# Altium project WCTopping.PrjPcb
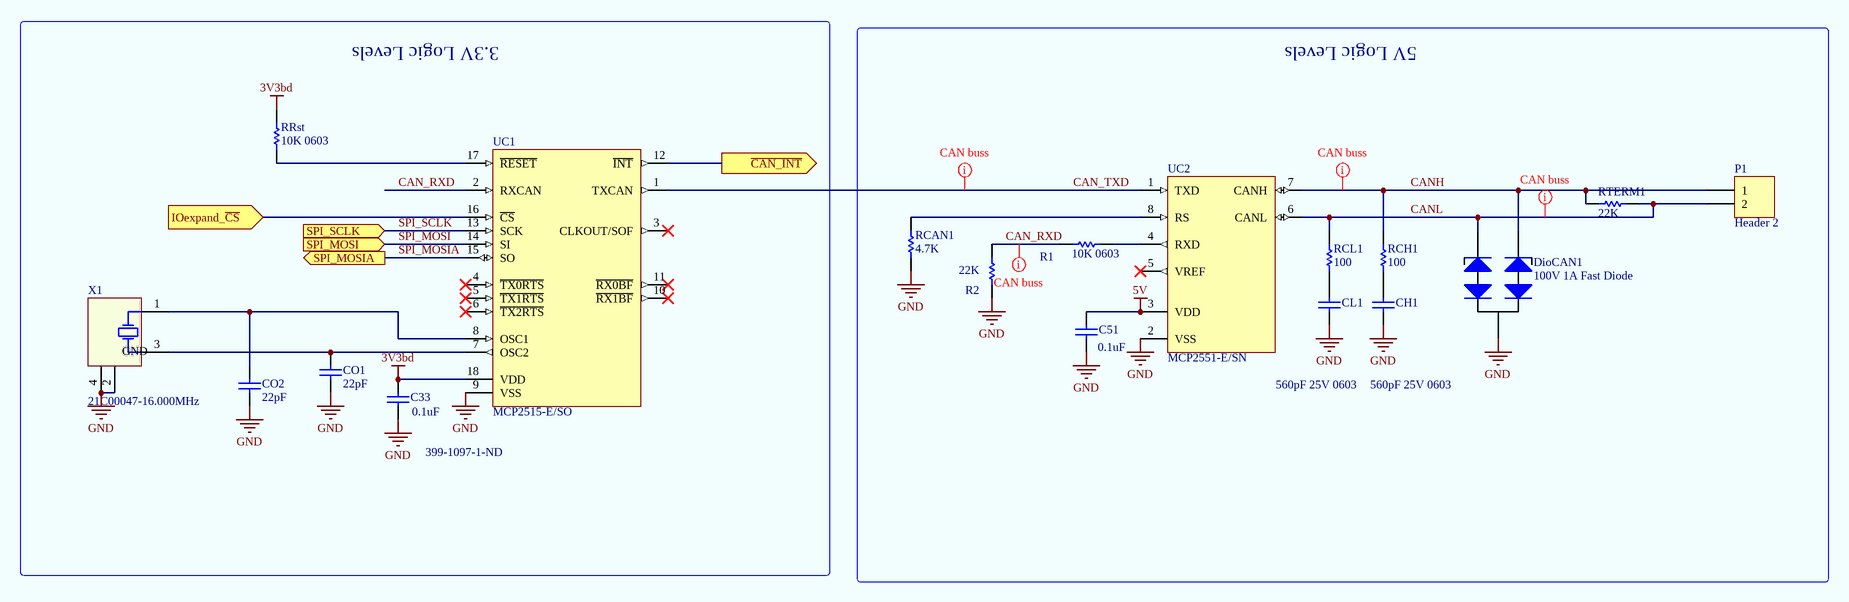
[diagram p0: CAN_Interface.SchDoc]
DrawnBy: TrainingTeam; Project_Name: WC Topping; Revision: 1.2; Title: Altium - Essential Training Example
3 sheets, 35 parts. Net scope: flat (ports and power ports of the same name join across sheets).
Board file: WCTopping.PcbDoc
Sheets:
  CAN_Interface.SchDoc
  Processor_Interface.SchDoc
  Digital_IO.SchDoc

## Sheet CAN_Interface.SchDoc: CAN Bus Interface Logic
size B; Engineer: Daisy Chain; DocumentNumber: 3; Revision: 2.3; SheetNumber: 3; SheetTotal: 5

### Parts
C33  0.1uF  Supplier Part Number 1: 399-1097-1-ND  [0603C_L]
C51  0.1uF  [0603C_L]
CH1  560pF 25V 0603  [0603C_L]
CL1  560pF 25V 0603  [0603C_L]
CO1  22pF  [0603C_L]
CO2  22pF  [0603C_L]
DioCAN1  100V 1A Fast Diode  [SOT23]
P1  Header 2  [HDR1X2]
R1  10K 0603  [0603_L]
R2  22K  [0603_L]
RCAN1  4.7K  [0603_L]
RCH1  100  [0603_L]
RCL1  100  [0603_L]
RRst  10K 0603  [0603_L]
RTERM1  22K  [0603_L]
UC1  MCP2515-E/SO  [SOIC-SO18_M]
UC2  MCP2551-E/SN  [SOIC-SN8_N]
X1  21C00047-16.000MHz  [ITTI-21C00047-16.000MHz-4_V]

### Blocks framed on the sheet
3.3V Logic Levels: C33 CO1 CO2 RRst UC1 X1
5V Logic Levels: C51 CH1 CL1 DioCAN1 P1 R1 R2 RCAN1 RCH1 RCL1 RTERM1 UC2

### Ports
IOexpand_~{CS} (in), SPI_MOSI (in), SPI_MOSIA (out), SPI_SCLK (in), ~{CAN_INT} (out)

### Nets
3V3bd: C33.2 RRst.2 UC1.18(VDD)
5V: C51.2 UC2.3(VDD)
GND: C33.1 C51.1 CH1.2 CL1.1 CO1.1 CO2.2 DioCAN1.3 R2.1 RCAN1.1 UC1.9(VSS) UC2.2(VSS) X1.2(GND) X1.4(GND)
CAN_RXD: R1.2 R2.2 UC1.2(RXCAN)
CAN_TXD: UC1.1(TXCAN) UC2.1(TXD)
CANH: DioCAN1.1(A) P1.1 RCH1.2 RTERM1.2 UC2.7(CANH)
CANL: DioCAN1.2(K) P1.2 RCL1.2 RTERM1.1 UC2.6(CANL)
GPIO4: UC1.16(~{CS}) ; port IOexpand_~{CS}
GPIO20: UC1.12(~{INT}) ; port ~{CAN_INT}
SPI_MOSI: UC1.14(SI) ; port SPI_MOSI
SPI_MOSIA: UC1.15(SO) ; port SPI_MOSIA
SPI_SCLK: UC1.13(SCK) ; port SPI_SCLK
NetCH1_1: CH1.1 RCH1.1
NetCL1_2: CL1.2 RCL1.1
NetCO1_2: CO1.2 UC1.7(OSC2) X1.3(XTAL)
NetCO2_1: CO2.1 UC1.8(OSC1) X1.1(XTAL)
NetR1_1: R1.1 UC2.4(RXD)
NetRCAN1_2: RCAN1.2 UC2.8(RS)
NetRRst_1: RRst.1 UC1.17(~{RESET})

Not connected (* = marked no-connect by the designer): UC1 3(CLKOUT/SOF)* 4(~{TX0RTS})* 5(~{TX1RTS})* 6(~{TX2RTS})* 10(~{RX1BF})* 11(~{RX0BF})*; UC2 5(VREF)*

### Layout directives
net class CAN; rule Width Constraint [Pref Width = 20mil    Min Width = 10mil    Max Width = 30mil]; rule Clearance Constraint [Clearance = 20mil]: CAN_RXD, CAN_TXD, CANH, CANL

### Notes on the sheet
- Title
- Size:
- Date:
- B
- Project:
- Time:
- Revision:
- Sheet
- of
- Engineer:
- File:

### Library data of the parts
C33 = Cap10uF_25V_0603: Manufacturer: Kemet; Manufacturer Part Number: C0603C104J4RACTU; Capacitance: 100nF; Tolerance: 5%; Voltage Rating: 16V; Type (Capacitors): X7R; Supplier 1: Digikey; Stock 1: 1096346; Pricing 1: 1=0.11, 10=0.078, 25=0.0572, 50=0.0446, 100=0.0369, 250=0.0305, 500=0.0259, 1000=0.0214 (USD); Mount: Surface Mount; Case/Package: 0603; Pins: 2; Case Code (Metric): 1608; Case Code (Imperial): 0603; Min Operating Temperature: -55°C; Max Operating Temperature: 125°C; Package Quantity: 4000; Packaging: Tape and Reel; Voltage Rating (DC): 16V; Length: 1.6mm; Height: 0.8mm; Width: 0.8mm; Radiation Hardening: No; REACH SVHC: No SVHC; ComponentLink1URL: https://datasheet.ciiva.com/14589/70095383-14589531.pdf; ComponentLink1Description: https://datasheet.ciiva.com/14589/70095383-14589531.pdf; ComponentLink2URL: https://datasheet.ciiva.com/28645/1851736-28645613.pdf; ComponentLink2Description: https://datasheet.ciiva.com/28645/1851736-28645613.pdf; ComponentLink3URL: https://datasheet.ciiva.com/5999/1732731-5999390.pdf; ComponentLink3Description: https://datasheet.ciiva.com/5999/1732731-5999390.pdf; ComponentLink4URL: https://datasheet.ciiva.com/7823/kem-c1002-x7r-smd-7823982.pdf; ComponentLink4Description: https://datasheet.ciiva.com/7823/kem-c1002-x7r-smd-7823982.pdf
C51 = Cap10uF_25V_0603
CH1 CL1 = Cap560pF_25V_0603: Manufacturer: Taiyo Yuden; Manufacturer Part Number: TMK316F106ZL-T; Catalog Drawings: xMK Series_1206_1.6; Capacitance: 10µF; Tolerance: -20%, +80%; Temperature Coefficient: Y5V (F); Online Catalog: M Series; Other Names: 587-1353-6; Supplier 1: Ciiva; Stock 1: 330483; Pricing 1: 1=0.34, 10=0.255, 50=0.1488, 100=0.119, 250=0.085, 500=0.0578, 1000=0.0468 (USD); Standard Package: 1; Category: Capacitors; Family: Ceramic Capacitors; Series: M; Packaging: Digi-Reel®; Voltage - Rated: 25V; Mounting Type: Surface Mount, MLCC; Operating Temperature: -30°C ~ 85°C; Applications: General Purpose; Ratings: -; Package / Case: 1206 (3216 Metric); Size / Dimension: 0.126" L x 0.063" W (3.20mm x 1.60mm); Height - Seated (Max): -; Thickness (Max): 0.071" (1.80mm); Lead Spacing: -; Features: -; Lead Style: -; ComponentLink1URL: https://datasheet.ciiva.com/30217/73tmk316f106zl-t-30217817.pdf; ComponentLink1Description: https://datasheet.ciiva.com/30217/73tmk316f106zl-t-30217817.pdf; ComponentLink2URL: https://datasheet.ciiva.com/11596/tmk316f106zl-t-ss-11596490.pdf; ComponentLink2Description: https://datasheet.ciiva.com/11596/tmk316f106zl-t-ss-11596490.pdf; ComponentLink3URL: https://datasheet.ciiva.com/137/tmk316f106zl-t-ss-137061.pdf; ComponentLink3Description: https://datasheet.ciiva.com/137/tmk316f106zl-t-ss-137061.pdf; ComponentLink4URL: https://datasheet.ciiva.com/15922/1123tmk316f106zl-t-15922467.pdf; ComponentLink4Description: https://datasheet.ciiva.com/15922/1123tmk316f106zl-t-15922467.pdf; ComponentLink5URL: https://datasheet.ciiva.com/7975/746258-7975854.pdf; ComponentLink5Description: https://datasheet.ciiva.com/7975/746258-7975854.pdf; ComponentLink6URL: https://datasheet.ciiva.com/7975/1693457-7975853.pdf; ComponentLink6Description: https://datasheet.ciiva.com/7975/1693457-7975853.pdf; ComponentLink7URL: https://datasheet.ciiva.com/5744/1497285-5744889.pdf; ComponentLink7Description: https://datasheet.ciiva.com/5744/1497285-5744889.pdf; Supplier Part Number 1: 587-1353-1-ND
CO1 = Cap22pF_50V_0603: Manufacturer: Murata; Manufacturer Part Number: GRM1885C1H220JA01D; Capacitance: 22; Voltage Rating: 50; Tolerance: 5; Type (Capacitors): C0G; Supplier 1: Digikey; Supplier Part Number 1: 490-1411-1-ND; Stock 1: 517556; Pricing 1: 1=0.1, 10=0.061, 50=0.0332, 100=0.0281, 250=0.023, 500=0.0196, 1000=0.0153 (USD); Mount: Surface Mount; Case/Package: 0603; Pins: 2; Case Code (Metric): 1608; Case Code (Imperial): 0603; Min Operating Temperature: -55; Max Operating Temperature: 125; Package Quantity: 1; Packaging: Cut Tape; Voltage Rating (DC): 50; Lead Pitch: 4; Length: 1.6; Height: 0.8; Width: 0.8; Radiation Hardening: No; REACH SVHC: No SVHC; ComponentLink1URL: https://datasheet.ciiva.com/131/product-131760.pdf; ComponentLink1Description: https://datasheet.ciiva.com/131/product-131760.pdf; ComponentLink2URL: https://datasheet.ciiva.com/131/partnumbering-e-01-131761.pdf; ComponentLink2Description: https://datasheet.ciiva.com/131/partnumbering-e-01-131761.pdf; ComponentLink3URL: https://datasheet.ciiva.com/14116/grmseries-tc-hitype-eng-14116853.pdf; ComponentLink3Description: https://datasheet.ciiva.com/14116/grmseries-tc-hitype-eng-14116853.pdf; ComponentLink4URL: https://datasheet.ciiva.com/3776/1156grm1885c1h220ja0123-3776984.pdf; ComponentLink4Description: https://datasheet.ciiva.com/3776/1156grm1885c1h220ja0123-3776984.pdf; ComponentLink5URL: https://datasheet.ciiva.com/14116/grmseries-tc-hitype-eng-14116826.pdf; ComponentLink5Description: https://datasheet.ciiva.com/14116/grmseries-tc-hitype-eng-14116826.pdf; ComponentLink6URL: https://datasheet.ciiva.com/11786/0900766b807a1cab-11786398.pdf; ComponentLink6Description: https://datasheet.ciiva.com/11786/0900766b807a1cab-11786398.pdf; ComponentLink7URL: https://datasheet.ciiva.com/131/partnumbering-e-01-131759.pdf; ComponentLink7Description: https://datasheet.ciiva.com/131/partnumbering-e-01-131759.pdf
CO2 = Cap100nF_50V_0603: Manufacturer: Murata; Manufacturer Part Number: GRM1885C1H220JA01D; Capacitance: 22; Voltage Rating: 50; Tolerance: 5; Type (Capacitors): C0G; Supplier 1: Digikey; Supplier Part Number 1: 490-1411-1-ND; Stock 1: 517556; Pricing 1: 1=0.1, 10=0.061, 50=0.0332, 100=0.0281, 250=0.023, 500=0.0196, 1000=0.0153 (USD); Mount: Surface Mount; Case/Package: 0603; Pins: 2; Case Code (Metric): 1608; Case Code (Imperial): 0603; Min Operating Temperature: -55; Max Operating Temperature: 125; Package Quantity: 1; Packaging: Cut Tape; Voltage Rating (DC): 50; Lead Pitch: 4; Length: 1.6; Height: 0.8; Width: 0.8; Radiation Hardening: No; REACH SVHC: No SVHC; ComponentLink1URL: https://datasheet.ciiva.com/131/product-131760.pdf; ComponentLink1Description: https://datasheet.ciiva.com/131/product-131760.pdf; ComponentLink2URL: https://datasheet.ciiva.com/131/partnumbering-e-01-131761.pdf; ComponentLink2Description: https://datasheet.ciiva.com/131/partnumbering-e-01-131761.pdf; ComponentLink3URL: https://datasheet.ciiva.com/14116/grmseries-tc-hitype-eng-14116853.pdf; ComponentLink3Description: https://datasheet.ciiva.com/14116/grmseries-tc-hitype-eng-14116853.pdf; ComponentLink4URL: https://datasheet.ciiva.com/3776/1156grm1885c1h220ja0123-3776984.pdf; ComponentLink4Description: https://datasheet.ciiva.com/3776/1156grm1885c1h220ja0123-3776984.pdf; ComponentLink5URL: https://datasheet.ciiva.com/14116/grmseries-tc-hitype-eng-14116826.pdf; ComponentLink5Description: https://datasheet.ciiva.com/14116/grmseries-tc-hitype-eng-14116826.pdf; ComponentLink6URL: https://datasheet.ciiva.com/11786/0900766b807a1cab-11786398.pdf; ComponentLink6Description: https://datasheet.ciiva.com/11786/0900766b807a1cab-11786398.pdf; ComponentLink7URL: https://datasheet.ciiva.com/131/partnumbering-e-01-131759.pdf; ComponentLink7Description: https://datasheet.ciiva.com/131/partnumbering-e-01-131759.pdf
DioCAN1 = PESD1CAN: High Conductance Fast Diode; Manufacturer: ON Semiconductor; Manufacturer Part Number: MUR110RLG; Diode Case Style: DO-204AL; Diode Configuration: Single; Diode Type: Fast Recovery; Forward Surge Current Ifsm Max: 35A; Forward Voltage VF Max: 1.25V; No. of Pins: 2; Reverse Recovery Time trr Max: 75ns; SVHC: No SVHC (16-Jun-2014); Supplier 1: Ciiva; Supplier Part Number 1: MUR110RLGOSCT-ND; Stock 1: 22453; Pricing 1: 1=0.48, 10=0.362, 100=0.2254, 500=0.1541, 1000=0.1185 (USD); Forward Current If(AV): 1A; Operating Temperature Max: 175°C; Packaging: Each; Repetitive Reverse Voltage Vrrm Max: 100V; ComponentLink1URL: https://datasheet.ciiva.com/915/mur120-d-915616.pdf; ComponentLink1Description: https://datasheet.ciiva.com/915/mur120-d-915616.pdf; ComponentLink2URL: https://datasheet.ciiva.com/30479/0900766b812212ee-30479481.pdf; ComponentLink2Description: https://datasheet.ciiva.com/30479/0900766b812212ee-30479481.pdf; ComponentLink3URL: https://datasheet.ciiva.com/25950/mur120-d-25950702.pdf; ComponentLink3Description: https://datasheet.ciiva.com/25950/mur120-d-25950702.pdf; ComponentLink4URL: https://datasheet.ciiva.com/16474/mur120-d-16474333.pdf; ComponentLink4Description: https://datasheet.ciiva.com/16474/mur120-d-16474333.pdf; ComponentLink5URL: https://datasheet.ciiva.com/915/mur120-d-915618.pdf; ComponentLink5Description: https://datasheet.ciiva.com/915/mur120-d-915618.pdf; ComponentLink6URL: https://datasheet.ciiva.com/915/mur120-d-915619.pdf; ComponentLink6Description: https://datasheet.ciiva.com/915/mur120-d-915619.pdf; ComponentLink7URL: https://datasheet.ciiva.com/16208/mur120-d-16208137.pdf; ComponentLink7Description: https://datasheet.ciiva.com/16208/mur120-d-16208137.pdf
P1 = Header 2: Header, 2-Pin; LatestRevisionDate: 17-Jul-2002; LatestRevisionNote: Re-released for DXP Platform.; Publisher: Altium Limited
R1 = Res4K99_0603: Manufacturer: Yageo; Manufacturer Part Number: RT0603DRD074K99L; Tolerance: ±0.5%; Power (Watts): 0.1W, 1/10W; Temperature Coefficient: ±25ppm/°C; Supplier 1: Digi-Key; RoHS: RoHS Compliant; Category: Resistors; Stock 1: 28874; Pricing 1: 1=0.22, 10=0.184, 25=0.134, 100=0.0721, 250=0.05532, 500=0.04358, 1000=0.03018, 2500=0.02766 (USD); Packaging: Cut Tape (CT); Part Status: Active; Resistance (Ohms): 10K; Composition: Thin Film; Features: Moisture Resistant; Operating Temperature: -55°C ~ 155°C; Package / Case: 0603 (1608 Metric); Supplier Device Package: 0603; Size / Dimension: 0.063" L x 0.031" W (1.60mm x 0.80mm); Height: 0.022" (0.55mm); Number of Terminations: 2; Failure Rate: -; ComponentLink1URL: http://www.yageo.com/documents/recent/PYu-RT_1-to-0.05_RoHS_L_6.pdf; ComponentLink1Description: http://www.yageo.com/documents/recent/PYu-RT_1-to-0.05_RoHS_L_6.pdf; Supplier Part Number 1: 311-10KDCT-ND
R2 RTERM1 = Res_0603: Manufacturer: Yageo; Manufacturer Part Number: RT0603DRD0722KL; Resistance: 22 kOhms; Tolerance: 0.5 %; Power Rating: 100 mW; Temperature Coefficient: 25 PPM / C; Voltage Rating: 75 V; Unit Weight: 0.000071 oz; Supplier 1: Digikey; Supplier Part Number 1: 311-22KDDKR-ND; Stock 1: 39729; Pricing 1: 1=0.12, 10=0.104, 25=0.0716, 50=0.0558, 100=0.0399, 250=0.0311, 500=0.0247, 1000=0.0175 (USD); Product Category: Thin Film Resistors - SMD; RoHS: True; Case Code - in: 0603; Case Code - mm: 1608; Operating Temperature Range: - 55 C to + 125 C; Series: RT; Packaging: Reel; Brand: Yageo; Height: 0.45 mm; Length: 1.6 mm; Package / Case: 0603 (1608 metric); Product: Thin Film Resistors SMD; Termination Style: SMD/SMT; Type: High Precision, High Stability; Width: 0.8 mm; ComponentLink1URL: https://datasheet.ciiva.com/12810/pyu-rt-1-to-0-05-rohs-l-4-12810773.pdf; ComponentLink1Description: https://datasheet.ciiva.com/12810/pyu-rt-1-to-0-05-rohs-l-4-12810773.pdf
RCAN1 = Res4K99_0603: Manufacturer: Yageo; Manufacturer Part Number: RT0603DRD074K99L; Resistance (Ohms): 4.99k; Tolerance: ±0.5%; Power (Watts): 0.1W, 1/10W; Temperature Coefficient: ±25ppm/°C; Supplier 1: Digi-Key; RoHS: RoHS Compliant; Category: Resistors; Stock 1: 28874; Pricing 1: 1=0.22, 10=0.184, 25=0.134, 100=0.0721, 250=0.05532, 500=0.04358, 1000=0.03018, 2500=0.02766 (USD); Packaging: Cut Tape (CT); Part Status: Active; Composition: Thin Film; Features: Moisture Resistant; Operating Temperature: -55°C ~ 155°C; Package / Case: 0603 (1608 Metric); Supplier Device Package: 0603; Size / Dimension: 0.063" L x 0.031" W (1.60mm x 0.80mm); Height: 0.022" (0.55mm); Number of Terminations: 2; Failure Rate: -; ComponentLink1URL: http://www.yageo.com/documents/recent/PYu-RT_1-to-0.05_RoHS_L_6.pdf; ComponentLink1Description: http://www.yageo.com/documents/recent/PYu-RT_1-to-0.05_RoHS_L_6.pdf; Supplier Part Number 1: 311-4.99KDCT-ND
RCH1 RCL1 = Res330_0603: Manufacturer: Yageo; Manufacturer Part Number: RC0603JR-07330RL; Resistance (Ohms): 330; Tolerance: ±5%; Power (Watts): 0.1W, 1/10W; Temperature Coefficient: ±100ppm/°C; Supplier 1: Digi-Key; RoHS: RoHS Compliant; Category: Resistors; Stock 1: 1303594; Pricing 1: 1=0.1, 10=0.011, 25=0.008, 100=0.0044, 250=0.00336, 500=0.0027, 1000=0.00198, 2500=0.00172 (USD); Packaging: Cut Tape (CT); Part Status: Active; Composition: Thick Film; Features: Moisture Resistant; Operating Temperature: -55°C ~ 155°C; Package / Case: 0603 (1608 Metric); Supplier Device Package: 0603; Size / Dimension: 0.063" L x 0.031" W (1.60mm x 0.80mm); Height: 0.022" (0.55mm); Number of Terminations: 2; Failure Rate: -; ComponentLink1URL: http://www.yageo.com/documents/recent/PYu-RC_Group_51_RoHS_L_04.pdf; ComponentLink1Description: http://www.yageo.com/documents/recent/PYu-RC_Group_51_RoHS_L_04.pdf; Supplier Part Number 1: 311-330GRCT-ND
RRst = Res10K_0603: Manufacturer: Panasonic Electronic Components; Manufacturer Part Number: ERJ-3GEYJ102V; Resistance (Ohms): 1k; Tolerance: ±5%; Power (Watts): 0.1W, 1/10W; Temperature Coefficient: ±200ppm/°C; Supplier 1: Digi-Key; RoHS: RoHS Compliant; Category: Resistors; Stock 1: 1335381; Pricing 1: 1=0.1, 50=0.0096, 100=0.0071, 250=0.00544, 500=0.00436, 1000=0.00321 (USD); Packaging: Cut Tape (CT); Part Status: Active; Composition: Thick Film; Features: Automotive AEC-Q200; Operating Temperature: -55°C ~ 155°C; Package / Case: 0603 (1608 Metric); Supplier Device Package: 0603; Size / Dimension: 0.063" L x 0.031" W (1.60mm x 0.80mm); Height: 0.022" (0.55mm); Number of Terminations: 2; Failure Rate: -; ComponentLink1URL: http://industrial.panasonic.com/www-cgi/jvcr13pz.cgi?E+PZ+3+AOA0001+ERJ3GEYJ102V+7+WW; ComponentLink1Description: http://industrial.panasonic.com/www-cgi/jvcr13pz.cgi?E+PZ+3+AOA0001+ERJ3GEYJ102V+7+WW; Supplier Part Number 1: P10KGCT-ND
UC1 = CMP-0186-00035-2: Stand-Alone CAN Controller With SPI Interface, 18-Pin SOIC, Extended Temperature; RevisionNote: URLs added. DatasheetVersion updated.; DatasheetVersion: revF, Oct-2010; ComponentLink2Description: Datasheet; ComponentLink3Description: Package Specification; ComponentLink1Description: Manufacturer URL; PackageReference: SOIC-SO18; PackageDescription: 18-Lead Plastic Small Outline (SO) - Wide 7.50mm Body [SOIC]; PackageVersion: revBB, Aug-2009; ComponentLink1URL: http://www.microchip.com/; ComponentLink3URL: http://www.microchip.com/stellent/groups/techpub_sg/documents/packagingspec/en012702.pdf; ComponentLink2URL: http://ww1.microchip.com/downloads/en/DeviceDoc/21801f.pdf; Code_JEDEC: MS-013
UC2 = CMP-0186-00038-2: High-Speed CAN Transceiver, 8-Pin SOIC, Extended Temperature; PackageReference: SOIC-SN8; Code_JEDEC: MS-012; ComponentLink1Description: Manufacturer URL; ComponentLink1URL: http://www.microchip.com/; PackageVersion: revBB, Aug-2009; ComponentLink3Description: Package Specification; Code_IPC: SOIC127P600-8; ComponentLink2URL: http://ww1.microchip.com/downloads/en/DeviceDoc/21667F.pdf; RevisionNote: URLs added. DatasheetVersion updated.; ComponentLink3URL: http://www.microchip.com/stellent/groups/techpub_sg/documents/packagingspec/en012702.pdf; DatasheetVersion: revF, Jul-2010; ComponentLink2Description: Datasheet; PackageDescription: 8-Lead Plastic Small Outline (SN) - Narrow, 3.90mm Body [SOIC]
X1 = CMP-0464-00001-2: Crystal, 16 MHz, -30 to 85 degC, 3.2 x 2.5 x 0.9 mm SMD; Manufacturer: ITTI; Frequency Tolerance: +/-20 ppm; Load Capacitance: 10 pF; Drive Level: 100 max. uw; Nominal Frequency: 16 MHz; Overtone order: Fundamental; ComponentLink1Description: Manufacturer URL; PackageDescription: 4-Pin Hand Drawn, Body 3.2 x 2.5mm; ComponentLink1URL: http://www.itti-co.com; PartNumber: 21C00047-16.000MHz; Operating temperature: -30 to 85 degC; PackageReference: 21C00047-16.000MHz-4; Mounting Technology: Surface Mount

## Sheet Processor_Interface.SchDoc: Processor 40pin GPIO Interface
size A; Engineer: D Board; DocumentNumber: 1; Revision: 1.2c; SheetNumber: 1; SheetTotal: 5
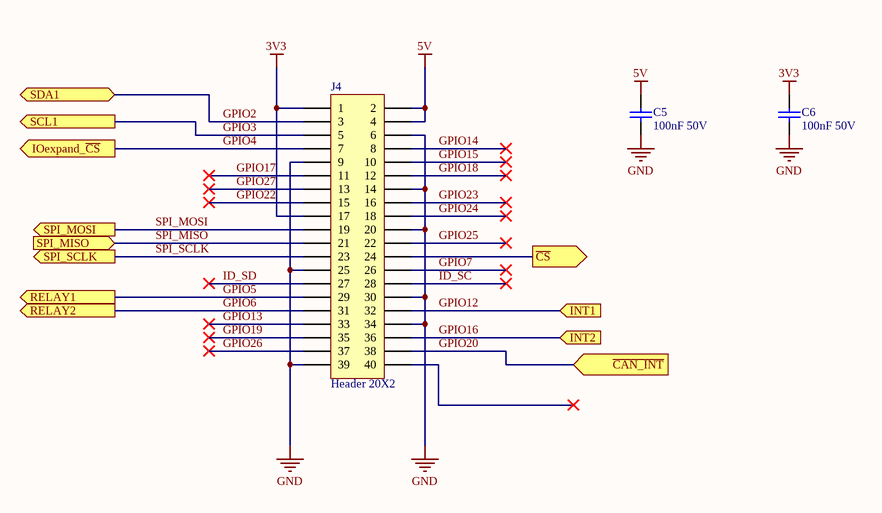
[diagram p1: Processor_Interface.SchDoc]

### Parts
C5  100nF 50V  [0603C_L]
C6  100nF 50V  [0603C_L]
J4  Header 20X2  [HDR2X20]

### Ports
INT1 (in), INT2 (in), IOexpand_~{CS} (out), RELAY1 (out), RELAY2 (out), SCL1 (out), SDA1 (bidir), SPI_MISO (in), SPI_MOSI (out), SPI_SCLK (out), ~{CAN_INT} (in), ~{CS} (out)

### Nets
3V3: C6.2 J4.1 J4.17
5V: C5.2 J4.2 J4.4
GND: C5.1 C6.1 J4.6 J4.9 J4.14 J4.20 J4.25 J4.30 J4.34 J4.39
~{CS}: J4.24 ; port ~{CS}
GPIO2: J4.3 ; port SDA1
GPIO3: J4.5 ; port SCL1
GPIO4: J4.7 ; port IOexpand_~{CS}
GPIO5: J4.29 ; port RELAY1
GPIO6: J4.31 ; port RELAY2
GPIO7: J4.26
GPIO12: J4.32 ; port INT1
GPIO13: J4.33
GPIO14: J4.8
GPIO15: J4.10
GPIO16: J4.36 ; port INT2
GPIO17: J4.11
GPIO18: J4.12
GPIO19: J4.35
GPIO20: J4.38 ; port ~{CAN_INT}
GPIO22: J4.15
GPIO23: J4.16
GPIO24: J4.18
GPIO25: J4.22
GPIO26: J4.37
GPIO27: J4.13
ID_SC: J4.28
ID_SD: J4.27
SPI_MISO: J4.21 ; port SPI_MISO
SPI_MOSI: J4.19 ; port SPI_MOSI
SPI_SCLK: J4.23 ; port SPI_SCLK

Not connected (* = marked no-connect by the designer): J4 40*

### Notes on the sheet
- Title
- Size:
- Date:
- A
- Project:
- Time:
- Revision:
- Sheet
- of
- Engineer:
- File:

### Library data of the parts
C5 C6 = Cap100nF_50V_0603: Manufacturer: Yageo; Manufacturer Part Number: CC0603ZRY5V9BB104; Capacitance: 0.10µF; Tolerance: -20%, +80%; Temperature Coefficient: Y5V (F); Supplier 1: Digi-Key; Supplier Part Number 1: 311-1343-1-ND; RoHS: RoHS Compliant; Category: Capacitors; Stock 1: 1827128; Pricing 1: 1=0.1, 10=0.018, 25=0.0128, 100=0.0082, 250=0.00672, 500=0.00574, 1000=0.00447 (USD); Packaging: Cut Tape (CT); Part Status: Active; Voltage - Rated: 50V; Operating Temperature: -30°C ~ 85°C; Features: -; Ratings: -; Applications: General Purpose; Failure Rate: -; Mounting Type: Surface Mount, MLCC; Package / Case: 0603 (1608 Metric); Size / Dimension: 0.063" L x 0.031" W (1.60mm x 0.80mm); Height - Seated (Max): -; Thickness (Max): 0.035" (0.90mm); Lead Spacing: -; Lead Style: -; ComponentLink1URL: http://www.yageo.com/documents/recent/UPY-GPHC_Y5V_6.3V-to-50V_6.pdf; ComponentLink1Description: http://www.yageo.com/documents/recent/UPY-GPHC_Y5V_6.3V-to-50V_6.pdf
J4 = Header 20X2: Header, 20-Pin, Dual row; LatestRevisionDate: 17-Jul-2002; LatestRevisionNote: Re-released for DXP Platform.; Publisher: Altium Limited

## Sheet Digital_IO.SchDoc: Digital IO Expansion Logic
size B; Engineer: Z Transform; DocumentNumber: 2; Revision: 1.1; SheetNumber: 2; SheetTotal: 5
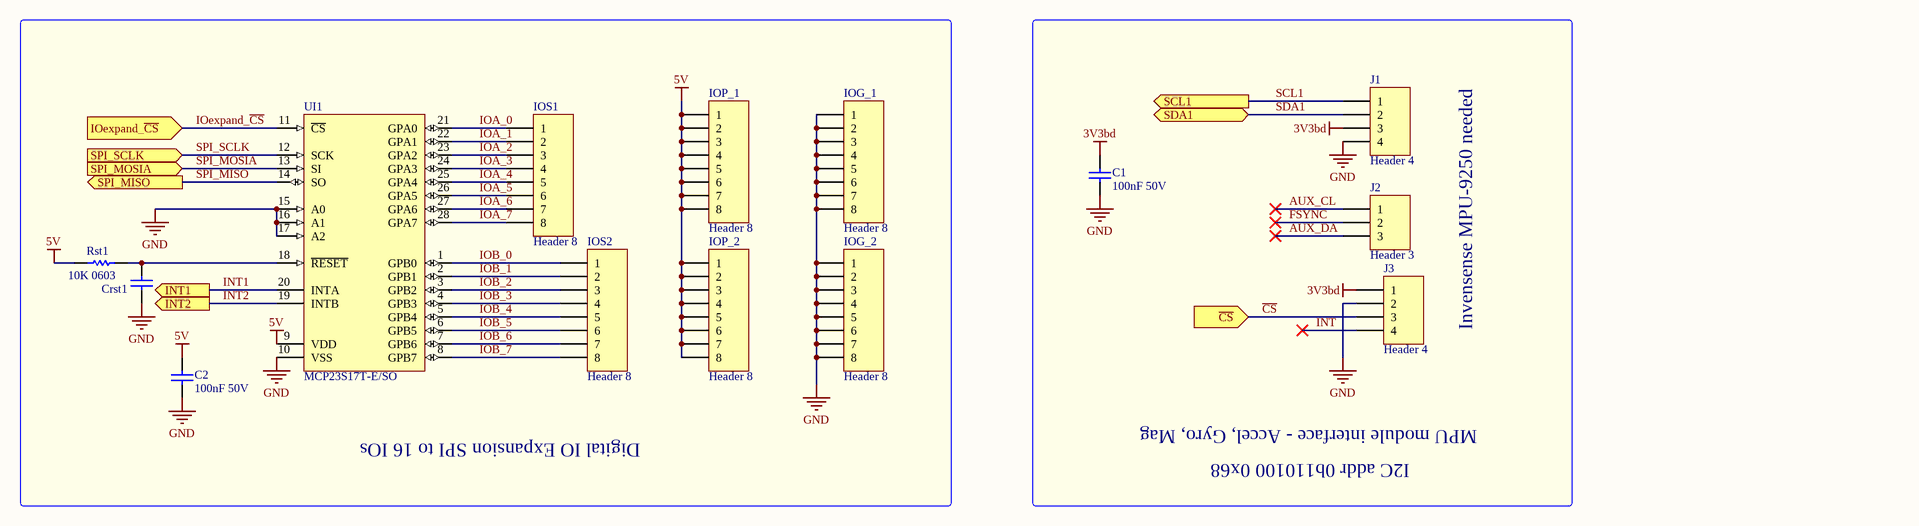
[diagram p2: Digital_IO.SchDoc]

### Parts
C1  100nF 50V  [0603C_L]
C2  100nF 50V  [0603C_L]
Crst1  100nF 50V  [0603C_L]  (value not drawn)
IOG_1  Header 8  [HDR1X8]
IOG_2  Header 8  [HDR1X8]
IOP_1  Header 8  [HDR1X8]
IOP_2  Header 8  [HDR1X8]
IOS1  Header 8  [HDR1X8]
IOS2  Header 8  [HDR1X8]
J1  Header 4  [HDR1X4]
J2  Header 3  [HDR1X3]
J3  Header 4  [HDR1X4]
Rst1  10K 0603  [0603_L]
UI1  MCP23S17T-E/SO  [SOIC-SO28_L]

### Blocks framed on the sheet
Digital IO Expansion SPI to 16 IOs: C2 Crst1 IOG_1 IOG_2 IOP_1 IOP_2 IOS1 IOS2 Rst1 UI1

### Ports
INT1 (out), INT2 (out), IOexpand_~{CS} (in), SCL1 (out), SDA1 (bidir), SPI_MISO (out), SPI_MOSIA (in), SPI_SCLK (in), ~{CS} (in)

### Nets
3V3bd: C1.2 J1.3 J3.1
5V: C2.2 IOP_1.1 IOP_1.2 IOP_1.3 IOP_1.4 IOP_1.5 IOP_1.6 IOP_1.7 IOP_1.8 IOP_2.1 IOP_2.2 IOP_2.3 IOP_2.4 IOP_2.5 IOP_2.6 IOP_2.7 IOP_2.8 Rst1.2 UI1.9(VDD)
GND: C1.1 C2.1 Crst1.1 IOG_1.1 IOG_1.2 IOG_1.3 IOG_1.4 IOG_1.5 IOG_1.6 IOG_1.7 IOG_1.8 IOG_2.1 IOG_2.2 IOG_2.3 IOG_2.4 IOG_2.5 IOG_2.6 IOG_2.7 IOG_2.8 J1.4 J3.2 UI1.10(VSS) UI1.15(A0) UI1.16(A1) UI1.17(A2)
AUX_CL: J2.1
AUX_DA: J2.3
~{CS}: J3.3 ; port ~{CS}
FSYNC: J2.2
INT: J3.4
INT1: UI1.20(INTA) ; port INT1  [project net GPIO12]
INT2: UI1.19(INTB) ; port INT2  [project net GPIO16]
IOA_0: IOS1.1 UI1.21(GPA0)
IOA_1: IOS1.2 UI1.22(GPA1)
IOA_2: IOS1.3 UI1.23(GPA2)
IOA_3: IOS1.4 UI1.24(GPA3)
IOA_4: IOS1.5 UI1.25(GPA4)
IOA_5: IOS1.6 UI1.26(GPA5)
IOA_6: IOS1.7 UI1.27(GPA6)
IOA_7: IOS1.8 UI1.28(GPA7)
IOB_0: IOS2.1 UI1.1(GPB0)
IOB_1: IOS2.2 UI1.2(GPB1)
IOB_2: IOS2.3 UI1.3(GPB2)
IOB_3: IOS2.4 UI1.4(GPB3)
IOB_4: IOS2.5 UI1.5(GPB4)
IOB_5: IOS2.6 UI1.6(GPB5)
IOB_6: IOS2.7 UI1.7(GPB6)
IOB_7: IOS2.8 UI1.8(GPB7)
IOexpand_~{CS}: UI1.11(~{CS}) ; port IOexpand_~{CS}  [project net GPIO4]
SCL1: J1.1 ; port SCL1  [project net GPIO3]
SDA1: J1.2 ; port SDA1  [project net GPIO2]
SPI_MISO: UI1.14(SO) ; port SPI_MISO
SPI_MOSIA: UI1.13(SI) ; port SPI_MOSIA
SPI_SCLK: UI1.12(SCK) ; port SPI_SCLK
NetCrst1_2: Crst1.2 Rst1.1 UI1.18(~{RESET})

### Notes on the sheet
- Invensense MPU-9250 needed
- MPU module interface - Accel, Gyro, Mag
- I2C addr 0b110100 0x68
- Title
- Size:
- Date:
- B
- Project:
- Time:
- Revision:
- Sheet
- of
- Engineer:
- File:

### Library data of the parts
C1 C2 Crst1 = Cap100nF_50V_0603: as C5 on sheet Processor_Interface; Supplier 1: Digi-Key; Supplier Part Number 1: 311-1343-1-ND; RoHS: RoHS Compliant; Category: Capacitors; Stock 1: 1827128; Pricing 1: 1=0.1, 10=0.018, 25=0.0128, 100=0.0082, 250=0.00672, 500=0.00574, 1000=0.00447 (USD); Packaging: Cut Tape (CT); Part Status: Active; Voltage - Rated: 50V; Operating Temperature: -30°C ~ 85°C; Features: -; Ratings: -; Applications: General Purpose; Failure Rate: -; Mounting Type: Surface Mount, MLCC; Package / Case: 0603 (1608 Metric); Size / Dimension: 0.063" L x 0.031" W (1.60mm x 0.80mm); Height - Seated (Max): -; Thickness (Max): 0.035" (0.90mm); Lead Spacing: -; Lead Style: -; ComponentLink1URL: http://www.yageo.com/documents/recent/UPY-GPHC_Y5V_6.3V-to-50V_6.pdf; ComponentLink1Description: http://www.yageo.com/documents/recent/UPY-GPHC_Y5V_6.3V-to-50V_6.pdf
IOG_1 IOG_2 IOP_1 IOP_2 IOS1 IOS2 = Header 8: Header, 8-Pin; LatestRevisionDate: 17-Jul-2002; LatestRevisionNote: Re-released for DXP Platform.; Publisher: Altium Limited
J1 J3 = Header 4: Header, 4-Pin; LatestRevisionDate: 17-Jul-2002; LatestRevisionNote: Re-released for DXP Platform.; Publisher: Altium Limited
J2 = Header 3: Header, 3-Pin; LatestRevisionDate: 17-Jul-2002; LatestRevisionNote: Re-released for DXP Platform.; Publisher: Altium Limited
Rst1 = Res10K_0603: as RRst on sheet CAN_Interface; Supplier 1: Digi-Key; RoHS: RoHS Compliant; Category: Resistors; Stock 1: 1335381; Pricing 1: 1=0.1, 50=0.0096, 100=0.0071, 250=0.00544, 500=0.00436, 1000=0.00321 (USD); Packaging: Cut Tape (CT); Part Status: Active; Composition: Thick Film; Features: Automotive AEC-Q200; Operating Temperature: -55°C ~ 155°C; Package / Case: 0603 (1608 Metric); Supplier Device Package: 0603; Size / Dimension: 0.063" L x 0.031" W (1.60mm x 0.80mm); Height: 0.022" (0.55mm); Number of Terminations: 2; Failure Rate: -; ComponentLink1URL: http://industrial.panasonic.com/www-cgi/jvcr13pz.cgi?E+PZ+3+AOA0001+ERJ3GEYJ102V+7+WW; ComponentLink1Description: http://industrial.panasonic.com/www-cgi/jvcr13pz.cgi?E+PZ+3+AOA0001+ERJ3GEYJ102V+7+WW; Supplier Part Number 1: P10KGCT-ND
UI1 = CMP-0186-00131-2: 16-Bit I/O Expander with Serial Interface, 28-Pin SOIC, Extended Temperature, Tape and Reel; PackageDescription: 28-Lead Plastic Small Outline (SO) - Wide 7.50mm Body [SOIC]; ComponentLink1URL: http://www.microchip.com/; Code_JEDEC: MS-013; ComponentLink3URL: http://www.microchip.com/stellent/groups/techpub_sg/documents/packagingspec/en012702.pdf; DatasheetVersion: revB, Feb-2007; ComponentLink2URL: http://ww1.microchip.com/downloads/en/DeviceDoc/21952b.pdf; ComponentLink2Description: Datasheet; ComponentLink3Description: Package Specification; PackageReference: SOIC-SO28; RevisionNote: URLs added. Sch pin type corrected.; ComponentLink1Description: Manufacturer URL; PackageVersion: revBB, Aug-2009

## Nets that join several sheets
3V3bd: CAN_Interface (C33.2 RRst.2 UC1.18), Digital_IO (C1.2 J1.3 J3.1)
5V: CAN_Interface (C51.2 UC2.3), Processor_Interface (C5.2 J4.2 J4.4), Digital_IO (19 pins)
GND: CAN_Interface (13 pins), Processor_Interface (10 pins), Digital_IO (25 pins)
~{CS}: Processor_Interface (J4.24), Digital_IO (J3.3)
GPIO2: Processor_Interface (J4.3), Digital_IO (J1.2)
GPIO3: Processor_Interface (J4.5), Digital_IO (J1.1)
GPIO4: CAN_Interface (UC1.16), Processor_Interface (J4.7), Digital_IO (UI1.11)
GPIO12: Processor_Interface (J4.32), Digital_IO (UI1.20)
GPIO16: Processor_Interface (J4.36), Digital_IO (UI1.19)
GPIO20: CAN_Interface (UC1.12), Processor_Interface (J4.38)
SPI_MISO: Processor_Interface (J4.21), Digital_IO (UI1.14)
SPI_MOSI: CAN_Interface (UC1.14), Processor_Interface (J4.19)
SPI_MOSIA: CAN_Interface (UC1.15), Digital_IO (UI1.13)
SPI_SCLK: CAN_Interface (UC1.13), Processor_Interface (J4.23), Digital_IO (UI1.12)